# Altium schematic sheet 01_MCU.SchDoc: =ProjectTitle
size A3; Organization: Nerdtronix GmbH; Address1: Industriestraße 14a; Address2: D-86438 Kissing; SheetNumber: 1; SheetTotal: 3
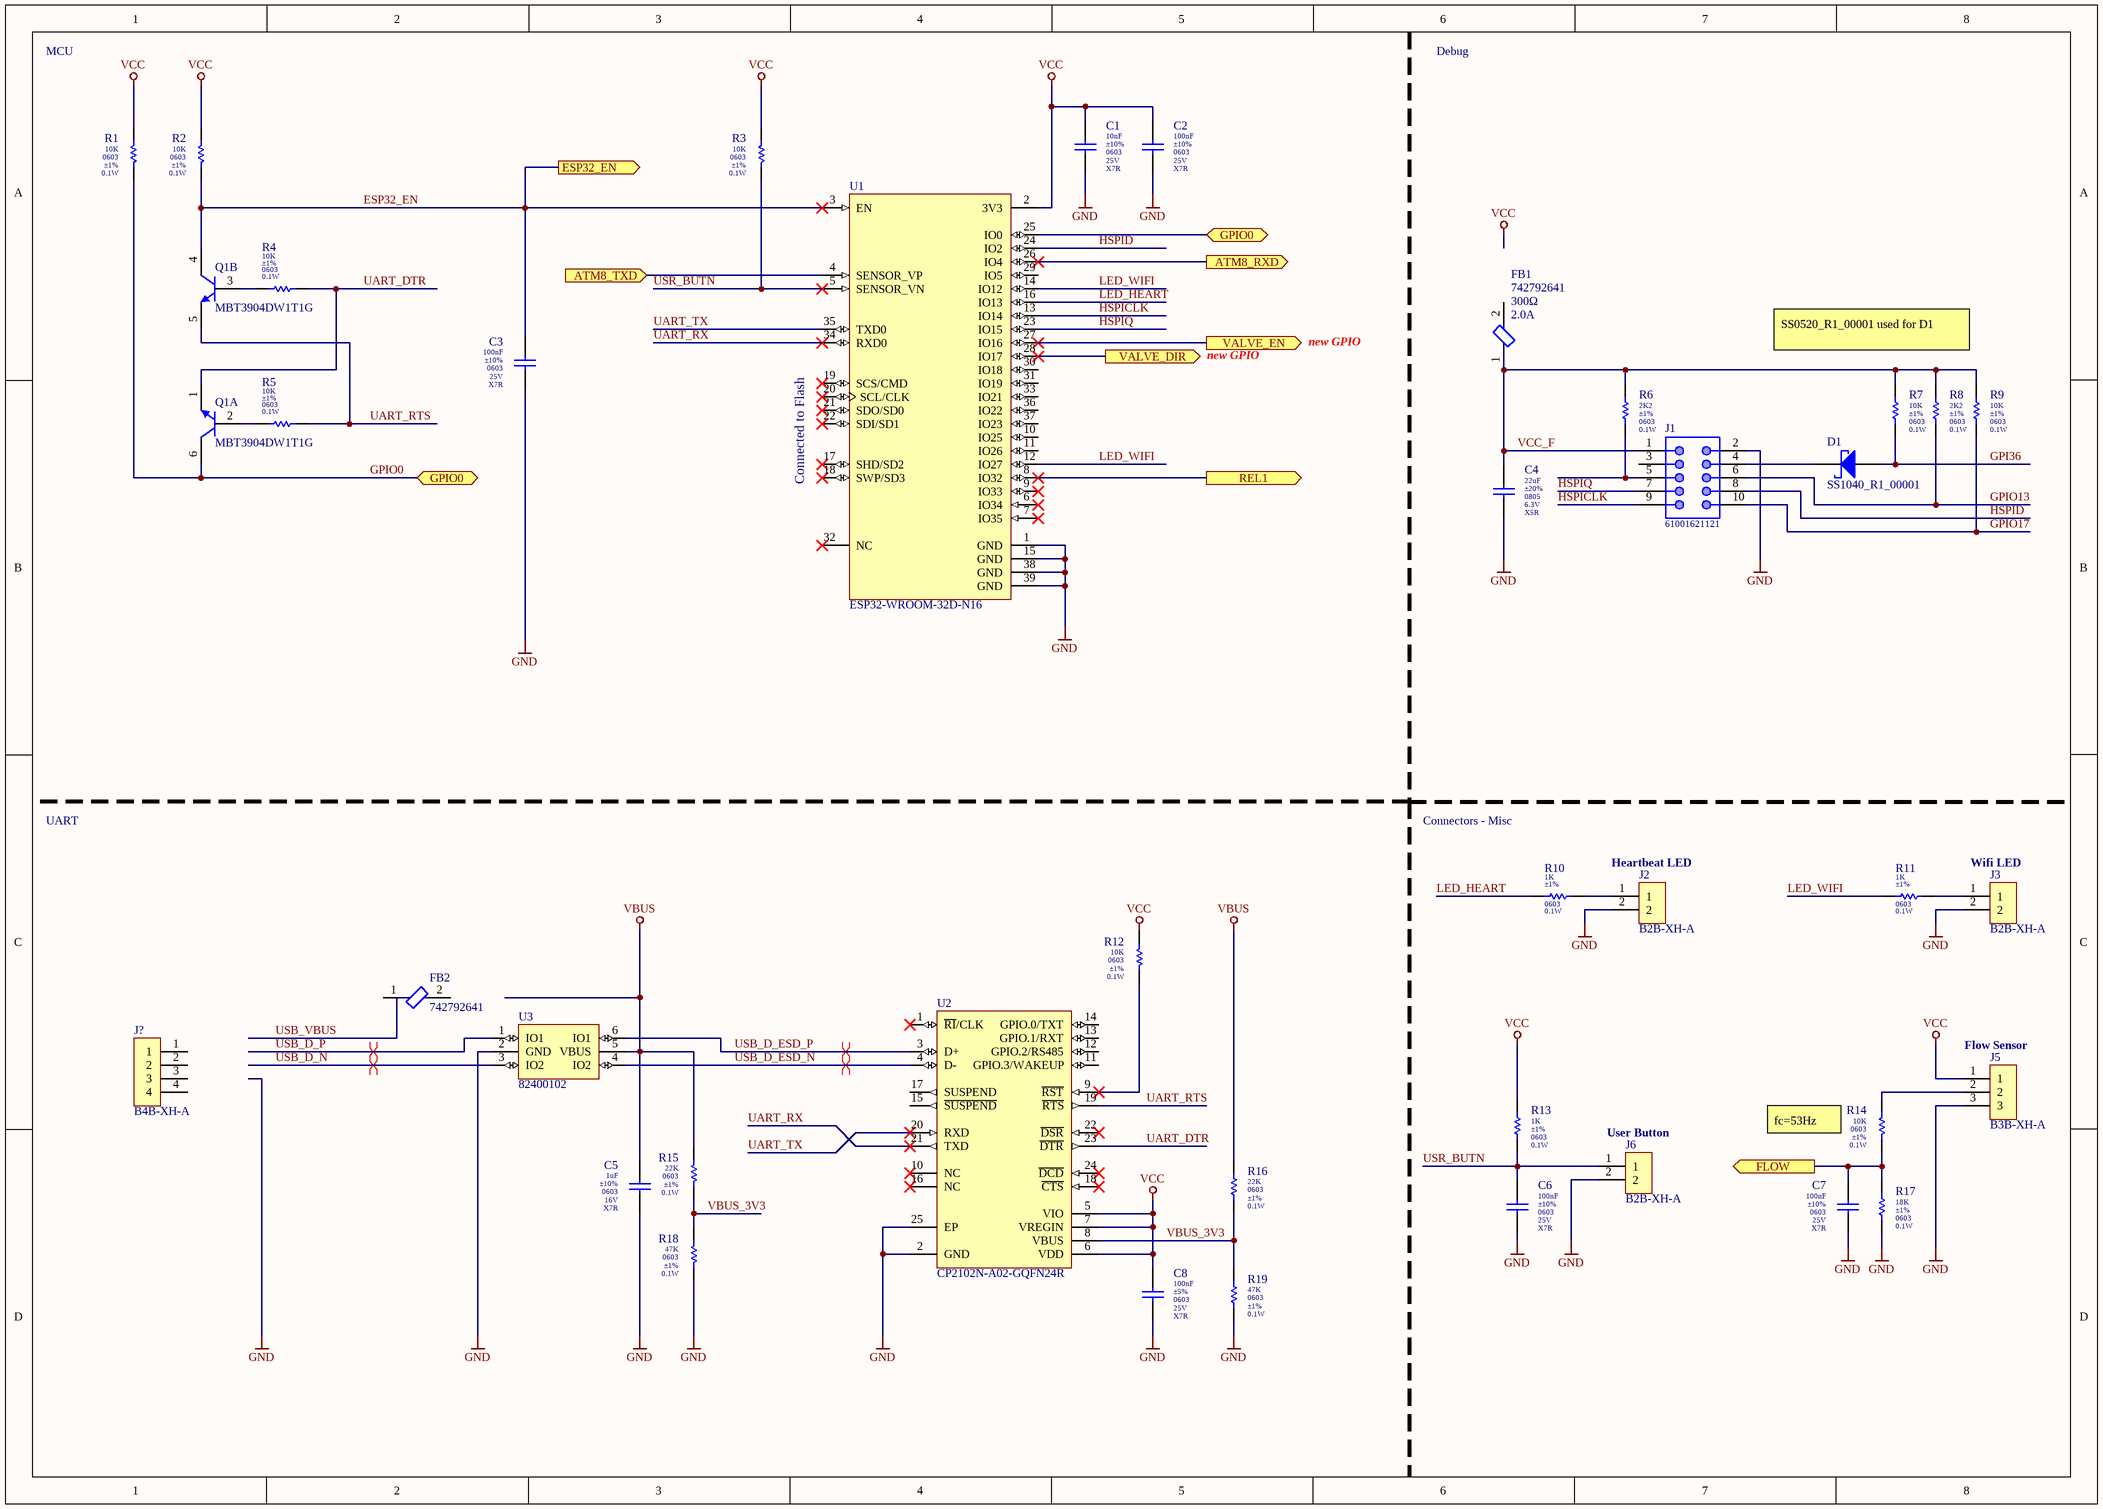
[diagram p0: 01_MCU.SchDoc]

## Parts
C1  value 10nF  Tolerance: ±10%  Package: 0603  Voltage: 25V  Dielectric: X7R  [C_0603_B]  (hidden comment: CL10B103KA8NNNC)
C2  value 100nF  Tolerance: ±10%  Package: 0603  Voltage: 25V  Dielectric: X7R  [C_0603_B]  (hidden comment: CL10B104KA8NNNC)
C3  value 100nF  Tolerance: ±10%  Package: 0603  Voltage: 25V  Dielectric: X7R  [C_0603_B]  (hidden comment: CL10B104KA8NNNC)
C4  value 22uF  Tolerance: ±20%  Package: 0805  Voltage: 6.3V  Dielectric: X5R  [C_0805_B]  (hidden comment: CL21A226MQQNNNE)
C5  value 1uF  Tolerance: ±10%  Package: 0603  Voltage: 16V  Dielectric: X7R  [C_0603_B]  (hidden comment: CL10B105KO8NNNC)
C6  value 100nF  Tolerance: ±10%  Package: 0603  Voltage: 25V  Dielectric: X7R  [C_0603_B]  (hidden comment: CL10B104KA8NNNC)
C7  value 100nF  Tolerance: ±10%  Package: 0603  Voltage: 25V  Dielectric: X7R  [C_0603_B]  (hidden comment: CL10B104KA8NNNC)
C8  value 100nF  Tolerance: ±5%  Package: 0603  Voltage: 25V  Dielectric: X7R  [C_0603_B]  (hidden comment: CL10B104JA8NNNC)
D1  SS1040_R1_00001  [SS1040_R1_00001]
FB1  742792641  I_max: 2.0A  Z@100MHz: 300Ω  [WE-CBF_0603_High Current]
FB2  742792641  [WE-CBF_0603_High Current]
J1  61001621121  [61001621121]
J2  B2B-XH-A  [JST_XH_2.54_2pin_vert]
J3  B2B-XH-A  [JST_XH_2.54_2pin_vert]
J5  B3B-XH-A  [JST_XH_2.54_3pin_vert]
J6  B2B-XH-A  [JST_XH_2.54_2pin_vert]
J?  B4B-XH-A  [JST_XH_2.54_4pin_vert]
Q1  MBT3904DW1T1G  [ONSC-SOT-363-6-419B-02_W_V]  (parts A,B of 2)
R1  value 10K  Package: 0603  Tolerance: ±1%  Power: 0.1W  [R_0603_B]  (hidden comment: RC0603FR-0710KL)
R2  value 10K  Package: 0603  Tolerance: ±1%  Power: 0.1W  [R_0603_B]  (hidden comment: RC0603FR-0710KL)
R3  value 10K  Package: 0603  Tolerance: ±1%  Power: 0.1W  [R_0603_B]  (hidden comment: RC0603FR-0710KL)
R4  value 10K  Package: 0603  Tolerance: ±1%  Power: 0.1W  [R_0603_B]  (hidden comment: RC0603FR-0710KL)
R5  value 10K  Package: 0603  Tolerance: ±1%  Power: 0.1W  [R_0603_B]  (hidden comment: RC0603FR-0710KL)
R6  value 2K2  Package: 0603  Power: 0.1W  Tolerance: ±1%  [R_0603_B]  (hidden comment: RC0603FR-072K2L)
R7  value 10K  Package: 0603  Power: 0.1W  Tolerance: ±1%  [R_0603_B]  (hidden comment: RC0603FR-0710KL)
R8  value 2K2  Package: 0603  Power: 0.1W  Tolerance: ±1%  [R_0603_B]  (hidden comment: RC0603FR-072K2L)
R9  value 10K  Package: 0603  Power: 0.1W  Tolerance: ±1%  [R_0603_B]  (hidden comment: RC0603FR-0710KL)
R10  value 1K  Package: 0603  Power: 0.1W  Tolerance: ±1%  [R_0603_B]  (hidden comment: RC0603FR-071KL)
R11  value 1K  Package: 0603  Power: 0.1W  Tolerance: ±1%  [R_0603_B]  (hidden comment: RC0603FR-071KL)
R12  value 10K  Package: 0603  Tolerance: ±1%  Power: 0.1W  [R_0603_B]  (hidden comment: RC0603FR-0710KL)
R13  value 1K  Package: 0603  Power: 0.1W  Tolerance: ±1%  [R_0603_B]  (hidden comment: RC0603FR-071KL)
R14  value 10K  Package: 0603  Tolerance: ±1%  Power: 0.1W  [R_0603_B]  (hidden comment: RC0603FR-0710KL)
R15  value 22K  Package: 0603  Tolerance: ±1%  Power: 0.1W  [R_0603_B]  (hidden comment: RC0603FR-0722KL)
R16  value 22K  Package: 0603  Tolerance: ±1%  Power: 0.1W  [R_0603_B]  (hidden comment: RC0603FR-0722KL)
R17  value 18K  Package: 0603  Power: 0.1W  Tolerance: ±1%  [R_0603_B]  (hidden comment: RC0603FR-0718KL)
R18  value 47K  Package: 0603  Tolerance: ±1%  Power: 0.1W  [R_0603_B]  (hidden comment: RC0603FR-0747KL)
R19  value 47K  Package: 0603  Tolerance: ±1%  Power: 0.1W  [R_0603_B]  (hidden comment: RC0603FR-0747KL)
U1  ESP32-WROOM-32D-N16  [MODULE_ESP32-WROOM-32D]
U2  CP2102N-A02-GQFN24R  [SLAB-QFN-24-2550x2550TP_A_V]
U3  82400102  [SOT95P280X145-6N]

## Ports
ATM8_RXD (out), ATM8_TXD (in), ESP32_EN (out), FLOW (out), GPIO0 (bidir), REL1 (out), VALVE_DIR (out), VALVE_EN (out)

## Nets
GND: C1.1 C2.1 C3.1 C4.1 C5.1 C6.1 C7.1 C8.1 J1.2 J2.2 J3.2 J5.3 J6.2 R17.1 R18.1 R19.1 U1.1(GND) U1.15(GND) U1.38(GND) U1.39(GND) U2.2(GND) U2.25(EP) U3.2(GND)
VBUS: C5.2 R15.2 R16.2 U3.5(VBUS)
VCC: C1.2 C2.2 C8.2 J5.1 R1.2 R2.2 R3.2 R12.2 R13.2 U1.2(3V3) U2.5(VIO) U2.6(VDD) U2.7(VREGIN)
ATM8_RXD: U1.26(IO4) ; port ATM8_RXD
ATM8_TXD: U1.4(SENSOR_VP) ; port ATM8_TXD
ESP32_EN: C3.2 Q1.4(C) R2.1 U1.3(EN) ; port ESP32_EN
FLOW: C7.2 R14.1 R17.2 ; port FLOW
GPI36: D1.A R7.1
GPIO0: Q1.6(C) R1.1 U1.25(IO0) ; port GPIO0
GPIO13: J1.6 R8.1
GPIO17: J1.10 R9.1
HSPICLK: J1.9 U1.13(IO14)
HSPID: J1.8 U1.24(IO2)
HSPIQ: J1.7 U1.23(IO15)
LED_HEART: R10.2 U1.16(IO13)
LED_WIFI: R11.2 U1.12(IO27) U1.14(IO12)
REL1: U1.8(IO32) ; port REL1
UART_DTR: Q1.1(E) R4.1 U2.23(~{DTR})
UART_RTS: Q1.5(E) R5.1 U2.19(~{RTS})
UART_RX: U1.34(RXD0) U2.21(TXD)
UART_TX: U1.35(TXD0) U2.20(RXD)
USB_D_ESD_N: U2.4(D-) U3.4(IO2)
USB_D_ESD_P: U2.3(D+) U3.6(IO1)
USB_D_N: U3.3(IO2)
USB_D_P: U3.1(IO1)
USR_BUTN: C6.2 J6.1 R3.1 R13.1 U1.5(SENSOR_VN)
VALVE_DIR: U1.28(IO17) ; port VALVE_DIR
VALVE_EN: U1.27(IO16) ; port VALVE_EN
VBUS_3V3: R15.1 R16.1 R18.2 R19.2 U2.8(VBUS)
VCC_F: C4.2 FB1.1 J1.1 R6.2 R7.2 R8.2 R9.2
NetD1_K: D1.K J1.4
NetJ1_5: J1.5 R6.1
NetJ2_1: J2.1 R10.1
NetJ3_1: J3.1 R11.1
NetJ5_2: J5.2 R14.2
NetQ1_2: Q1.2(B) R5.2
NetQ1_3: Q1.3(B) R4.2
NetR12_1: R12.1 U2.9(~{RST})

Not connected (* = marked no-connect by the designer): FB1 2; FB2 1 2; J1 3; J? 1 2 3 4; U1 6(IO34)* 7(IO35)* 9(IO33)* 10(IO25) 11(IO26) 17(SHD/SD2)* 18(SWP/SD3)* 19(SCS/CMD)* 20(SCL/CLK)* 21(SDO/SD0)* 22(SDI/SD1)* 29(IO5) 30(IO18) 31(IO19) 32(NC)* 33(IO21) 36(IO22) 37(IO23); U2 1(~{RI}/CLK)* 10(NC)* 11(GPIO.3/WAKEUP) 12(GPIO.2/RS485) 13(GPIO.1/RXT) 14(GPIO.0/TXT) 15(~{SUSPEND}) 16(NC)* 17(SUSPEND) 18(~{CTS})* 22(~{DSR})* 24(~{DCD})*

## Layout directives
differential pair; differential pair class USB_D: USB_D_ESD_N, USB_D_ESD_P, USB_D_N, USB_D_P

## Notes on the sheet
- MCU
- Debug
- new GPIO
- SS0520_R1_00001 used for D1
- (near U1) Connected to Flash
- UART
- Connectors - Misc
- (near J2) Heartbeat LED
- (near J3) Wifi LED
- (near J5) Flow Sensor
- (near J6) User Button
- (near R14) fc=53Hz
- Title
- Size:
- Date:
- A3
- Number:
- Time:
- Revision:
- Sheet
- of
- Author:
- File:

## Library data of the parts
C1 = CMP-001-00194-31: CAP 10nF 25V 0603 ±10% X7R; Manufacturer: Samsung; Pad Count: 2; Packaging: Cut Tape; Manufacturer Part Number: CL10B103KA8NNNC; Mounting Type: SMT; Distributor Ordering Code: 1276-1132-1-ND; Creator: MSt 10-08-21; Distributor: Digikey; Minimum Operating Temperature: -55; Maximum Operating Temperature: 125; RoHS: Yes
C2 C6 C7 = CMP-001-00198-28: CAP 100nF 25V 0603 ±10% X7R; Manufacturer: Samsung; Revision Status: new; Placed: Yes; Pad Count: 2; Maximum Operating Temperature: 125; Distributor Ordering Code: 1276-1006-1-ND; Creator: Mst 10-08-21; Packaging: cut tape; RoHS: yes; Distributor: Digikey; Minimum Operating Temperature: -55; Mounting Type: SMD; Manufacturer Part Number: CL10B104KA8NNNC
C3 = CMP-001-00198-28: CAP 100nF 25V 0603 ±10% X7R; Manufacturer: Samsung; Placed: Yes; Revision Status: new; Pad Count: 2; Creator: Mst 10-08-21; Mounting Type: SMD; Distributor Ordering Code: 1276-1006-1-ND; Maximum Operating Temperature: 125; Manufacturer Part Number: CL10B104KA8NNNC; Packaging: cut tape; Minimum Operating Temperature: -55; RoHS: yes; Distributor: Digikey
C4 = CMP-001-00489-27: CAP 22uF 6.3V 0805 ±20% X5R; Manufacturer: Samsung; Pad Count: 2; Revision Status: new; Placed: Yes; Minimum Operating Temperature: -55; Packaging: cut tape; Distributor: Digikey; Mounting Type: SMD; Manufacturer Part Number: CL21A226MQQNNNE; Maximum Operating Temperature: 85; Creator: Mst 10-08-21; RoHS: yes; Distributor Ordering Code: 1276-1100-1-ND
C5 = CMP-001-00192-28: CAP 1uF 16V 0603 ±10% X7R; Manufacturer: Samsung; Pad Count: 2; Placed: Yes; Revision Status: new; Creator: Mst 10-08-21; Distributor Ordering Code: 1276-1019-1-ND; Manufacturer Part Number: CL10B105KO8NNNC; Minimum Operating Temperature: -55; RoHS: yes; Mounting Type: SMD; Maximum Operating Temperature: 125; Packaging: cut tape; Distributor: Digikey
C8 = CMP-001-00197-28: CAP 100nF 25V 0603 ±5% X7R; Manufacturer: Samsung; Revision Status: new; Placed: Yes; Pad Count: 2; Creator: Mst 10-08-21; Manufacturer Part Number: CL10B104JA8NNNC; Maximum Operating Temperature: 125; Distributor: Digikey; RoHS: yes; Minimum Operating Temperature: -55; Mounting Type: SMD; Distributor Ordering Code: 1276-1929-1-ND; Packaging: cut tape
D1 = CMP-004-00002-7: Schottky Diode, 0.55V UF@IF=1A, 1A IF_max, SOD-123; Manufacturer: Panjit International; Pad Count: 2; UF: 0.55V; Packaging: Cut Tape; RoHS: yes; Mounting Type: SMT; Distributor: Digikey; Distributor Ordering Code: 3757-SS1040_R1_00001CT-ND; Manufacturer Part Number: SS1040_R1_00001; Design Item ID: SS1040_R1_00001; Maximum Operating Temperature: 125; Minimum Operating Temperature: -55; Creator: MSt 06-02-22; IF: 1A
FB1 = CMP-002-000813-11: WE-CBF SMT EMI Suppression Ferrite Bead 0603 300Ohm@100MHz 2A; Manufacturer: Wuerth Elektronik; Pad Count: 2; DCR_max: 150mΩ; Creator: MSt 08-12-21; Minimum Operating Temperature: -55; Packaging: Cut Tape; Maximum Operating Temperature: 125; Manufacturer Part Number: 742792641; Mounting Type: SMT; RoHS: Yes; Distributor Ordering Code: 732-1592-1-ND; Distributor: Digikey
FB2 = CMP-002-000813-11: WE-CBF SMT EMI Suppression Ferrite Bead 0603 300Ohm@100MHz 2A; Manufacturer: Wuerth Elektronik; I_max: 2.0A; Pad Count: 2; Z@100MHz: 300Ω; DCR_max: 150mΩ; Creator: MSt 08-12-21; Minimum Operating Temperature: -55; Packaging: Cut Tape; Maximum Operating Temperature: 125; Manufacturer Part Number: 742792641; Mounting Type: SMT; RoHS: Yes; Distributor Ordering Code: 732-1592-1-ND; Distributor: Digikey
J1 = CMP-002-00004-2: WR-PHD Pin Header, SMT, pitch 2.54mm, Dual Row, Vertical, 16p; Manufacturer: Wuerth Elektronik; Manufacturer Part Number: 61001021121; Pad Count: 10; Distributor Ordering Code: 732-5463-5-ND; ComponentLink1Description: Datasheet; Maximum Operating Temperature: 105; Design Item ID: 61001621121; Distributor: Digikey; ComponentLink1URL: https://www.we-online.com/catalog/datasheet/61001621121.pdf; Minimum Operating Temperature: -40; Packaging: Tube; Creator: MSt 06-02-22; RoHS: Yes; Mounting Type: SMT; Source: 10-pol.SchLib
J2 J3 J6 = CMP-002-000810-10: JST XH-A-series straight THT 2-pol.; Manufacturer Part Number: B2B-XH-A(LF)(SN); Pad Count: 2; Design Item ID: B2B-XH-A; Mounting Type: THT; Distributor Ordering Code: 455-2247-ND; RoHS: Yes; Packaging: Bag; Creator: MSt 29-11-21; Manufacturer: JST; Maximum Operating Temperature: 85; Distributor: Digikey; Minimum Operating Temperature: -25
J5 = CMP-002-000811-10: JST XH-A-series straight THT 3-pol.; Manufacturer Part Number: B3B-XH-A(LF)(SN); Pad Count: 3; Distributor Ordering Code: 455-2248-ND; Maximum Operating Temperature: 85; Distributor: Digikey; Creator: MSt 29-11-21; Manufacturer: JST; Packaging: Bag; RoHS: Yes; Mounting Type: THT; Design Item ID: B3B-XH-A; Minimum Operating Temperature: -25
J? = CMP-002-000812-18: JST XH-A-series straight THT 4-pol.; Manufacturer Part Number: B4B-XH-A(LF)(SN); Pad Count: 4; Creator: MSt 19-05-23; Mounting Type: THT; Distributor: Digikey; Design Item ID: B4B-XH-A; Manufacturer: JST; RoHS: Yes; Distributor Ordering Code: 455-2249-ND; Maximum Operating Temperature: 85; Packaging: Bag; Minimum Operating Temperature: -25
Q1 = CMP-013-00000-3: Dual General Purpose NPN Transistors; Manufacturer: Central Semiconductor Corp; Pad Count: 6; Revision Status: new; Placed: yes; Distributor: Digikey; RoHS: yes; Minimum Operating Temperature: -65; Maximum Operating Temperature: 150; Packaging: cut tape; Manufacturer Part Number: CMKT3920 TR PBFREE; Distributor Ordering Code: 1514-CMKT3920TRPBFREECT-ND; Mounting Type: SMD; Creator: MSt 28-11-21
R1-R5 R7 R9 R12 R14 = CMP-002-004901-43: RES 10K 0603 1% 0.1W; Manufacturer: Yageo; Maximum Voltage: 150V; Pad Count: 2; Mounting Type: SMT; Packaging: Cut Tape; Distributor: Digikey; Creator: MSt 26-08-21; Minimum Operating Temperature: -55; Manufacturer Part Number: RC0603FR-0710KL; RoHS: Yes; Maximum Operating Temperature: 155; Distributor Ordering Code: 311-10.0KHRCT-ND
R6 R8 = CMP-002-000321-18: RES 2K2 0603 1% 0.1W; Manufacturer: Yageo; Pad Count: 2; Maximum Voltage: 150V; Mounting Type: SMT; RoHS: Yes; Packaging: Cut Tape; Creator: MSt 12-11-21; Distributor: Digikey; Manufacturer Part Number: RC0603FR-072K2L; Minimum Operating Temperature: -55; Maximum Operating Temperature: 155; Distributor Ordering Code: 311-2.20KHRCT-ND
R10 R11 R13 = CMP-002-004805-43: RES 1K 0603 1% 0.1W; Manufacturer: Yageo; Maximum Voltage: 150V; Pad Count: 2; Mounting Type: SMT; RoHS: Yes; Creator: MSt 26-08-21; Minimum Operating Temperature: -55; Manufacturer Part Number: RC0603FR-071KL; Distributor Ordering Code: 311-1.00KHRCT-ND; Maximum Operating Temperature: 155; Distributor: Digikey; Packaging: Cut Tape
R15 R16 = CMP-002-000339-18: RES 22K 0603 1% 0.1W; Manufacturer: Yageo; Maximum Voltage: 150V; Pad Count: 2; Manufacturer Part Number: RC0603FR-0722KL; Distributor Ordering Code: 311-22.0KHRCT-ND; Creator: MSt 12-11-21; Packaging: Cut Tape; Minimum Operating Temperature: -55; Distributor: Digikey; RoHS: Yes; Maximum Operating Temperature: 155; Mounting Type: SMT
R17 = CMP-002-000338-18: RES 18K 0603 1% 0.1W; Manufacturer: Yageo; Pad Count: 2; Maximum Voltage: 150V; Maximum Operating Temperature: 155; Mounting Type: SMT; Manufacturer Part Number: RC0603FR-0718KL; Packaging: Cut Tape; Distributor: Digikey; Distributor Ordering Code: 311-18.0KHRCT-ND; Minimum Operating Temperature: -55; Creator: MSt 12-11-21; RoHS: Yes
R18 R19 = CMP-002-000347-18: RES 47K 0603 1% 0.1W; Manufacturer: Yageo; Maximum Voltage: 150V; Pad Count: 2; Packaging: Cut Tape; Maximum Operating Temperature: 155; Distributor: Digikey; RoHS: Yes; Mounting Type: SMT; Manufacturer Part Number: RC0603FR-0747KL; Distributor Ordering Code: 311-47.0KHRCT-ND; Minimum Operating Temperature: -55; Creator: MSt 12-11-21
U1 = CMP-013-000000-9: ESP32-WROOM-32D-N16 16MB Flash; Manufacturer: Espressif Systems; Pad Count: 39; Creator: MSt 05-10-21; Mounting Type: SMT; Packaging: Cut Tape; Minimum Operating Temperature: -40; Maximum Operating Temperature: 85; RoHS: Yes; Distributor Ordering Code: 1965-ESP32-WROOM-32D-N16CT-ND; Manufacturer Part Number: ESP32-WROOM-32D-N16; Distributor: Digikey
U2 = CMP-001-0012-2: USB Interface IC USBXpress - USB to UART Bridge; Manufacturer: Silicon Labs; Revision Status: new; Placed: yes; Pad Count: 25; Distributor Ordering Code: 634-CP2102NA02QFN24R; Distributor: Mouser; Packaging: cut tape; Mounting Type: SMD; Creator: MSt 29-11-21; RoHS: yes; Manufacturer Part Number: CP2102N-A02-GQFN24R; Minimum Operating Temperature: -40; Maximum Operating Temperature: 85
U3 = CMP-001-0008-2: 82400102, USB ESD protection; Manufacturer: Wuerth Elektronik; Pad Count: 6; Placed: yes; Revision Status: new; Manufacturer Part Number: 82400102; Maximum Operating Temperature: 125; Mounting Type: SMD; RoHS: yes; Creator: MSt 29-11-21; Packaging: cut tape; Minimum Operating Temperature: -55; Distributor Ordering Code: 732-4473-1-ND; Distributor: Digikey